# EAGLE schematic JLC_PCB_7_19 (EAGLE 9.6.2)
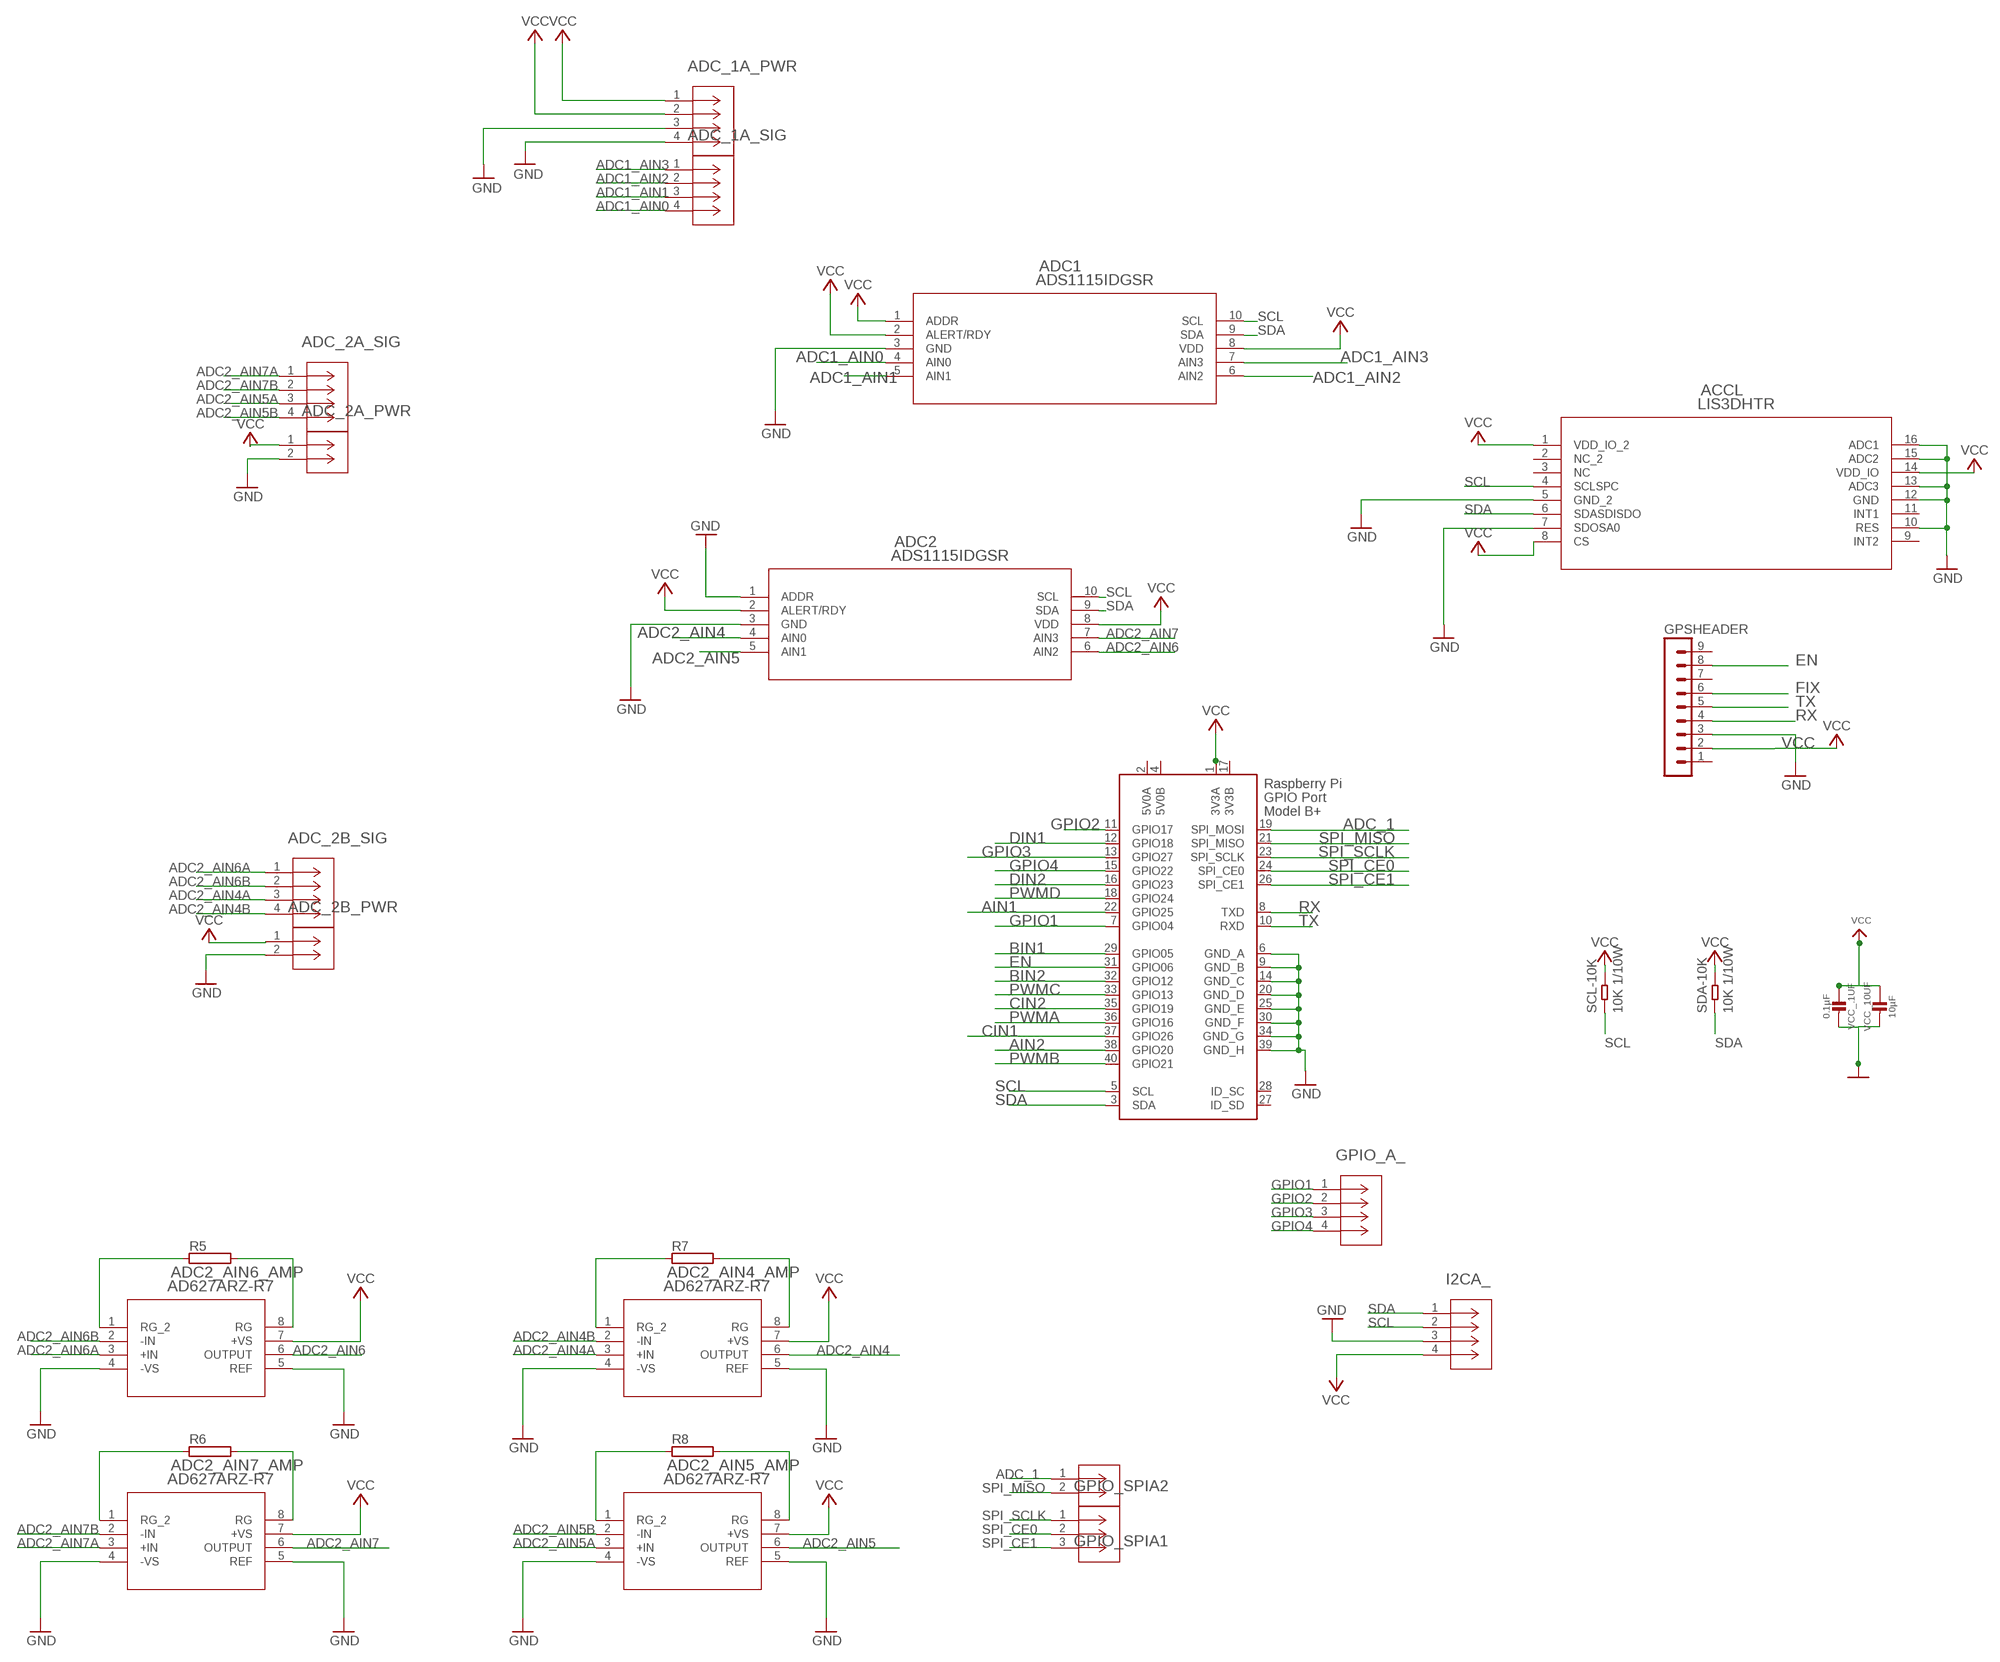
[diagram p0: schematic, sheet 1, part 1 of 2]
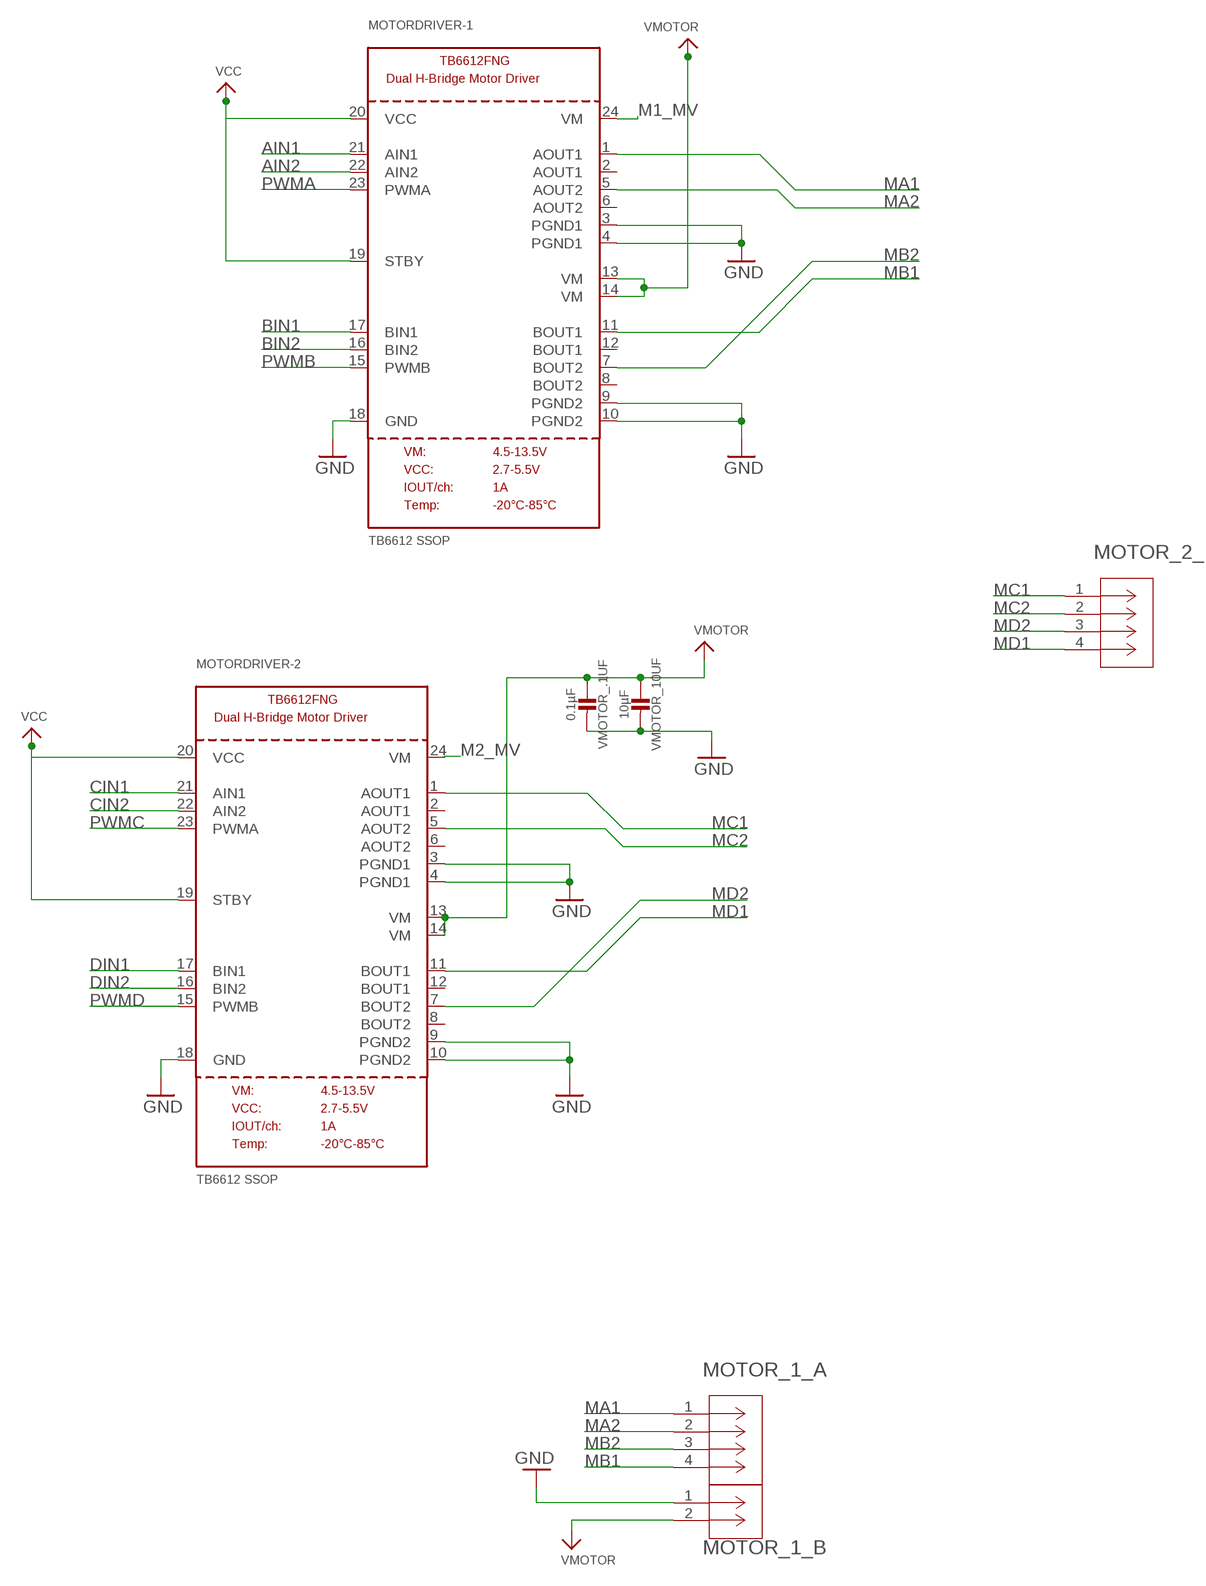
[diagram p1: schematic, sheet 1, part 2 of 2]

## Parts
ACCL  LIS3DHTR  [LGA-16_3X3X1MM]
ADC1  ADS1115IDGSR  [DGS10]
ADC2  ADS1115IDGSR  [DGS10]
ADC2_AIN4_AMP  AD627ARZ-R7  [R_8_ADI]
ADC2_AIN5_AMP  AD627ARZ-R7  [R_8_ADI]
ADC2_AIN6_AMP  AD627ARZ-R7  [R_8_ADI]
ADC2_AIN7_AMP  AD627ARZ-R7  [R_8_ADI]
ADC_1A_PWR  1715048  [CONN_1715048_PXC]
ADC_1A_SIG  1715048  [CONN_1715048_PXC]
ADC_2A_PWR  1730612  [CONN02_1730612_11P34X11P62_PXC]
ADC_2A_SIG  1715048  [CONN_1715048_PXC]
ADC_2B_PWR  1730612  [CONN02_1730612_11P34X11P62_PXC]
ADC_2B_SIG  1715048  [CONN_1715048_PXC]
GPIO_A_  1715048  [CONN_1715048_PXC]
GPIO_SPIA1  1730612  [CONN02_1730612_11P34X11P62_PXC]
GPIO_SPIA2  1730405  [CONN_1730405_PXC]
GPSHEADER  MA09-1  [MA09-1]
I2CA_  1715048  [CONN_1715048_PXC]
MOTOR_1_A  1715048  [CONN_1715048_PXC]
MOTOR_1_B  1730612  [CONN02_1730612_11P34X11P62_PXC]
MOTOR_2_  1715048  [CONN_1715048_PXC]
MOTORDRIVER-1  TB6612 SSOP  TB6612FNGSSOP  [SSOP24]
MOTORDRIVER-2  TB6612 SSOP  TB6612FNGSSOP  [SSOP24]
PI_HEADER  RASPI_GPIO_B+#_BOX  [RASPI_GPIO_B+_BOX]
R5  RHPS58  [HPS58]
R6  RHPS58  [HPS58]
R7  RHPS58  [HPS58]
R8  RHPS58  [HPS58]
SCL-10K  10K 1/10W  SMD-RES-10K-5%-1/10W(0603)  [R0603]
SDA-10K  10K 1/10W  SMD-RES-10K-5%-1/10W(0603)  [R0603]
VCC_10UF  10µF  CAP_CERAMIC0805-NOOUTLINE  [0805-NO]
VCC_.1UF  0.1µF  CAP_CERAMIC0805-NOOUTLINE  [0805-NO]
VMOTOR_10UF  10µF  CAP_CERAMIC0805-NOOUTLINE  [0805-NO]
VMOTOR_.1UF  0.1µF  CAP_CERAMIC0805-NOOUTLINE  [0805-NO]

## Nets
ADC1_AIN0: ADC1.4(AIN0) ADC_1A_SIG.4
ADC1_AIN1: ADC1.5(AIN1) ADC_1A_SIG.3
ADC1_AIN2: ADC1.6(AIN2) ADC_1A_SIG.2
ADC1_AIN3: ADC1.7(AIN3) ADC_1A_SIG.1
ADC2_AIN4: ADC2.4(AIN0) ADC2_AIN4_AMP.6(OUTPUT)
ADC2_AIN4A: ADC2_AIN4_AMP.3(+IN) ADC_2B_SIG.3
ADC2_AIN4B: ADC2_AIN4_AMP.2(-IN) ADC_2B_SIG.4
ADC2_AIN5: ADC2.5(AIN1) ADC2_AIN5_AMP.6(OUTPUT)
ADC2_AIN5A: ADC2_AIN5_AMP.3(+IN) ADC_2A_SIG.3
ADC2_AIN5B: ADC2_AIN5_AMP.2(-IN) ADC_2A_SIG.4
ADC2_AIN6: ADC2.6(AIN2) ADC2_AIN6_AMP.6(OUTPUT)
ADC2_AIN6A: ADC2_AIN6_AMP.3(+IN) ADC_2B_SIG.1
ADC2_AIN6B: ADC2_AIN6_AMP.2(-IN) ADC_2B_SIG.2
ADC2_AIN7: ADC2.7(AIN3) ADC2_AIN7_AMP.6(OUTPUT)
ADC2_AIN7A: ADC2_AIN7_AMP.3(+IN) ADC_2A_SIG.1
ADC2_AIN7B: ADC2_AIN7_AMP.2(-IN) ADC_2A_SIG.2
ADC_1: GPIO_SPIA1.1 PI_HEADER.19(SPI_MOSI)
AIN1: MOTORDRIVER-1.21(AIN1) PI_HEADER.22(GPIO25)
AIN2: MOTORDRIVER-1.22(AIN2) PI_HEADER.38(GPIO20)
BIN1: MOTORDRIVER-1.17(BIN1) PI_HEADER.29(GPIO05)
BIN2: MOTORDRIVER-1.16(BIN2) PI_HEADER.32(GPIO12)
CIN1: MOTORDRIVER-2.21(AIN1) PI_HEADER.37(GPIO26)
CIN2: MOTORDRIVER-2.22(AIN2) PI_HEADER.35(GPIO19)
DIN1: MOTORDRIVER-2.17(BIN1) PI_HEADER.12(GPIO18)
DIN2: MOTORDRIVER-2.16(BIN2) PI_HEADER.16(GPIO23)
EN: GPSHEADER.8 PI_HEADER.31(GPIO06)
FIX: GPSHEADER.6
GND: ACCL.5(GND_2) ACCL.7(SDOSA0) ACCL.10(RES) ACCL.12(GND) ACCL.13(ADC3) ACCL.15(ADC2) ACCL.16(ADC1) ADC1.3(GND) ADC2.1(ADDR) ADC2.3(GND) ADC2_AIN4_AMP.4(-VS) ADC2_AIN4_AMP.5(REF) ADC2_AIN5_AMP.4(-VS) ADC2_AIN5_AMP.5(REF) ADC2_AIN6_AMP.4(-VS) ADC2_AIN6_AMP.5(REF) ADC2_AIN7_AMP.4(-VS) ADC2_AIN7_AMP.5(REF) ADC_1A_PWR.3 ADC_1A_PWR.4 ADC_2A_PWR.2 ADC_2B_PWR.2 GPSHEADER.3 I2CA_.3 MOTOR_1_B.1 MOTORDRIVER-1.3(PGND1) MOTORDRIVER-1.4(PGND1) MOTORDRIVER-1.9(PGND2) MOTORDRIVER-1.10(PGND2) MOTORDRIVER-1.18(GND) MOTORDRIVER-2.3(PGND1) MOTORDRIVER-2.4(PGND1) MOTORDRIVER-2.9(PGND2) MOTORDRIVER-2.10(PGND2) MOTORDRIVER-2.18(GND) PI_HEADER.6(GND_A) PI_HEADER.9(GND_B) PI_HEADER.14(GND_C) PI_HEADER.20(GND_D) PI_HEADER.25(GND_E) PI_HEADER.30(GND_F) PI_HEADER.34(GND_G) PI_HEADER.39(GND_H) VCC_10UF.2 VCC_.1UF.2 VMOTOR_10UF.2 VMOTOR_.1UF.2
GPIO1: GPIO_A_.1 PI_HEADER.7(GPIO04)
GPIO2: GPIO_A_.2 PI_HEADER.11(GPIO17)
GPIO3: GPIO_A_.3 PI_HEADER.13(GPIO27)
GPIO4: GPIO_A_.4 PI_HEADER.15(GPIO22)
M1_MV: MOTORDRIVER-1.24(VM)
M2_MV: MOTORDRIVER-2.24(VM)
MA1: MOTOR_1_A.1 MOTORDRIVER-1.1(AOUT1)
MA2: MOTOR_1_A.2 MOTORDRIVER-1.5(AOUT2)
MB1: MOTOR_1_A.4 MOTORDRIVER-1.11(BOUT1)
MB2: MOTOR_1_A.3 MOTORDRIVER-1.7(BOUT2)
MC1: MOTOR_2_.1 MOTORDRIVER-2.1(AOUT1)
MC2: MOTOR_2_.2 MOTORDRIVER-2.5(AOUT2)
MD1: MOTOR_2_.4 MOTORDRIVER-2.11(BOUT1)
MD2: MOTOR_2_.3 MOTORDRIVER-2.7(BOUT2)
N$15: ADC2_AIN6_AMP.1(RG_2) R5.1
N$16: ADC2_AIN6_AMP.8(RG) R5.2
N$17: ADC2_AIN4_AMP.1(RG_2) R7.1
N$18: ADC2_AIN4_AMP.8(RG) R7.2
N$19: ADC2_AIN5_AMP.1(RG_2) R8.1
N$20: ADC2_AIN5_AMP.8(RG) R8.2
N$21: ADC2_AIN7_AMP.1(RG_2) R6.1
N$22: ADC2_AIN7_AMP.8(RG) R6.2
PWMA: MOTORDRIVER-1.23(PWMA) PI_HEADER.36(GPIO16)
PWMB: MOTORDRIVER-1.15(PWMB) PI_HEADER.40(GPIO21)
PWMC: MOTORDRIVER-2.23(PWMA) PI_HEADER.33(GPIO13)
PWMD: MOTORDRIVER-2.15(PWMB) PI_HEADER.18(GPIO24)
RX: GPSHEADER.4 PI_HEADER.8(TXD)
SCL: ACCL.4(SCLSPC) ADC1.10(SCL) ADC2.10(SCL) I2CA_.2 PI_HEADER.5(SCL) SCL-10K.1
SDA: ACCL.6(SDASDISDO) ADC1.9(SDA) ADC2.9(SDA) I2CA_.1 PI_HEADER.3(SDA) SDA-10K.1
SPI_CE0: GPIO_SPIA2.2 PI_HEADER.24(SPI_CE0)
SPI_CE1: GPIO_SPIA2.3 PI_HEADER.26(SPI_CE1)
SPI_MISO: GPIO_SPIA1.2 PI_HEADER.21(SPI_MISO)
SPI_SCLK: GPIO_SPIA2.1 PI_HEADER.23(SPI_SCLK)
TX: GPSHEADER.5 PI_HEADER.10(RXD)
VCC: ACCL.1(VDD_IO_2) ACCL.8(CS) ACCL.14(VDD_IO) ADC1.1(ADDR) ADC1.2(ALERT/RDY) ADC1.8(VDD) ADC2.2(ALERT/RDY) ADC2.8(VDD) ADC2_AIN4_AMP.7(+VS) ADC2_AIN5_AMP.7(+VS) ADC2_AIN6_AMP.7(+VS) ADC2_AIN7_AMP.7(+VS) ADC_1A_PWR.1 ADC_1A_PWR.2 ADC_2A_PWR.1 ADC_2B_PWR.1 GPSHEADER.2 I2CA_.4 MOTORDRIVER-1.19(STBY) MOTORDRIVER-1.20(VCC) MOTORDRIVER-2.19(STBY) MOTORDRIVER-2.20(VCC) PI_HEADER.1(3V3A) SCL-10K.2 SDA-10K.2 VCC_10UF.1 VCC_.1UF.1
VMOTOR: MOTOR_1_B.2 MOTORDRIVER-1.13(VM) MOTORDRIVER-1.14(VM) MOTORDRIVER-2.13(VM) MOTORDRIVER-2.14(VM) VMOTOR_10UF.1 VMOTOR_.1UF.1
Unconnected: ACCL.2(NC_2) ACCL.3(NC) ACCL.9(INT2) ACCL.11(INT1) GPSHEADER.1 GPSHEADER.7 GPSHEADER.9 MOTORDRIVER-1.2(AOUT1) MOTORDRIVER-1.6(AOUT2) MOTORDRIVER-1.8(BOUT2) MOTORDRIVER-1.12(BOUT1) MOTORDRIVER-2.2(AOUT1) MOTORDRIVER-2.6(AOUT2) MOTORDRIVER-2.8(BOUT2) MOTORDRIVER-2.12(BOUT1) PI_HEADER.27(ID_SD) PI_HEADER.28(ID_SC)

## Power pins joined to a net without a drawn wire
3V3B: PI_HEADER.17(3V3B)
5V0A: PI_HEADER.2(5V0A)
5V0B: PI_HEADER.4(5V0B)

## Library data of the parts
ACCL = Capstone:LIS3DHTR; MANUFACTURER_PART_NUMBER: LIS3DHTR; VENDOR: STMicroelectronics
ADC1 ADC2 = Capstone:ADS1115IDGSR; MANUFACTURER_PART_NUMBER: ADS1115IDGSR; VENDOR: Texas Instruments
ADC2_AIN4_AMP ADC2_AIN5_AMP ADC2_AIN6_AMP ADC2_AIN7_AMP = Amplifier:AD627ARZ-R7; COPYRIGHT: Copyright (C) 2023 Ultra Librarian. All rights reserved.; DIGIKEY_PART_NUMBER_1: AD627ARZ-R7CT-ND; DIGIKEY_PART_NUMBER_2: AD627ARZ-R7DKR-ND; DIGIKEY_PART_NUMBER_3: AD627ARZ-R7TR-ND; MANUFACTURER_PART_NUMBER: AD627ARZ-R7; MFR_NAME: Analog Devices Inc
ADC_1A_PWR ADC_1A_SIG ADC_2A_SIG ADC_2B_SIG GPIO_A_ I2CA_ MOTOR_1_A MOTOR_2_ = ScrewTerminals:1715048; COPYRIGHT: Copyright (C) 2023 Ultra Librarian. All rights reserved.; MANUFACTURER_PART_NUMBER: 1715048; MFR_NAME: Phoenix Contact
ADC_2A_PWR ADC_2B_PWR GPIO_SPIA1 MOTOR_1_B = ScrewTerminals:1730612; COPYRIGHT: Copyright (C) 2023 Ultra Librarian. All rights reserved.; MANUFACTURER_PART_NUMBER: 1730612; MFR_NAME: Phoenix Contact
GPIO_SPIA2 = ScrewTerminals:1730405; COPYRIGHT: Copyright (C) 2023 Ultra Librarian. All rights reserved.; MANUFACTURER_PART_NUMBER: 1730405; MFR_NAME: Phoenix Contact
GPSHEADER = con-lstb:MA09-1: PIN HEADER; OC_FARNELL: unknown; OC_NEWARK: unknown
MOTORDRIVER-1 MOTORDRIVER-2 = microbuilder:TB6612FNG: TB6612FNG Dual H-Bridge Motor Driver
PI_HEADER = raspberrypi_bastelstube_v13:RASPI_GPIO_B+#: 2x20 header connector, all pins connected
R5-R8 = resistor-power:R: Power Resitor; OC_FARNELL: unknown; OC_NEWARK: unknown
SCL-10K SDA-10K = Seeed-Resistor:SMD-RES-10K-5%-1/10W(0603): 301010293; MPN: RC0603JR-0710KL
VCC_10UF VCC_.1UF VMOTOR_10UF VMOTOR_.1UF = microbuilder:CAP_CERAMIC: Ceramic Capacitors For new designs, use the packages preceded by an '_' character since they are more reliable: The following footprints should be used on most boards: _0402 - Standard footprint for regular board layouts _0603 - Standard footprint for regular board layouts _0805 - Standard footprint for regular board layouts _1206 - Standard footprint for regular board layouts For extremely tight-pitch boards where space is at a premium, the following 'micro-pitch' footprints can be used (smaller pads, no silkscreen outline, etc.): _0402MP - Micro-pitch footprint for very dense/compact boards _0603MP - Micro-pitch footprint for very dense/compact boards _0805MP - Micro-pitch footprint for very dense/compact boards _1206MP - Micro-pitch footprint for very dense/compact boards